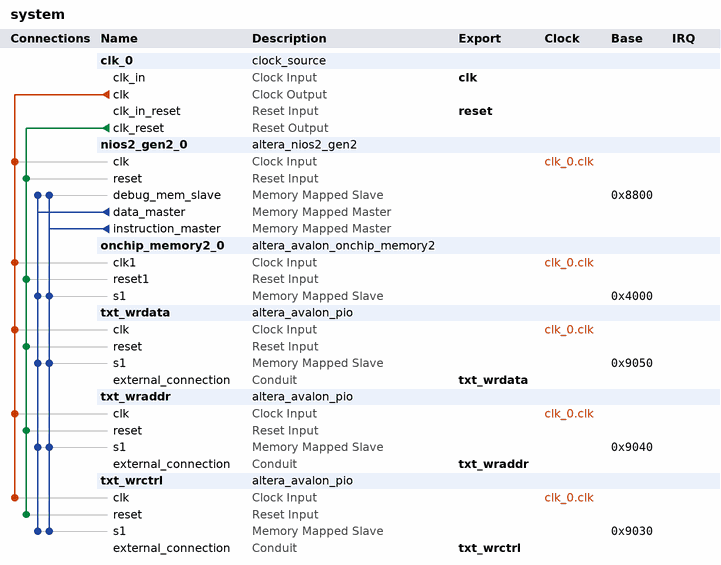
[diagram p0: system contents]
# Platform Designer (Qsys) system system, Cyclone 10 LP 10CL010YE144C8G
# Parameters at their usual value, and those the tool derives, are not listed.
package require -exact qsys 17.1
create_system system
set_project_property DEVICE_FAMILY {Cyclone 10 LP}
set_project_property DEVICE 10CL010YE144C8G

add_instance clk_0 clock_source 17.1
set_instance_parameter_value clk_0 clockFrequency 50000000

add_instance nios2_gen2_0 altera_nios2_gen2 17.1
set_instance_parameter_value nios2_gen2_0 dcache_size 2048
set_instance_parameter_value nios2_gen2_0 exceptionSlave Absolute
set_instance_parameter_value nios2_gen2_0 icache_size 4096
set_instance_parameter_value nios2_gen2_0 impl Tiny
set_instance_parameter_value nios2_gen2_0 resetSlave Absolute

add_instance onchip_memory2_0 altera_avalon_onchip_memory2 17.1
set_instance_parameter_value onchip_memory2_0 dataWidth 32
set_instance_parameter_value onchip_memory2_0 dualPort false
set_instance_parameter_value onchip_memory2_0 initMemContent true
set_instance_parameter_value onchip_memory2_0 initializationFileName onchip_mem.hex
set_instance_parameter_value onchip_memory2_0 memorySize 15360

add_instance txt_wrdata altera_avalon_pio 17.1
set_instance_parameter_value txt_wrdata direction Output
set_instance_parameter_value txt_wrdata width 3

add_instance txt_wraddr altera_avalon_pio 17.1
set_instance_parameter_value txt_wraddr direction Output
set_instance_parameter_value txt_wraddr width 16

add_instance txt_wrctrl altera_avalon_pio 17.1
set_instance_parameter_value txt_wrctrl direction Output
set_instance_parameter_value txt_wrctrl width 2

# connections
add_connection clk_0.clk nios2_gen2_0.clk clock
add_connection clk_0.clk onchip_memory2_0.clk1 clock
add_connection clk_0.clk txt_wraddr.clk clock
add_connection clk_0.clk txt_wrctrl.clk clock
add_connection clk_0.clk txt_wrdata.clk clock
add_connection clk_0.clk_reset nios2_gen2_0.reset reset
add_connection clk_0.clk_reset onchip_memory2_0.reset1 reset
add_connection clk_0.clk_reset txt_wraddr.reset reset
add_connection clk_0.clk_reset txt_wrctrl.reset reset
add_connection clk_0.clk_reset txt_wrdata.reset reset
add_connection nios2_gen2_0.data_master nios2_gen2_0.debug_mem_slave avalon
set_connection_parameter_value nios2_gen2_0.data_master/nios2_gen2_0.debug_mem_slave baseAddress 0x8800
add_connection nios2_gen2_0.data_master onchip_memory2_0.s1 avalon
set_connection_parameter_value nios2_gen2_0.data_master/onchip_memory2_0.s1 baseAddress 0x4000
add_connection nios2_gen2_0.data_master txt_wraddr.s1 avalon
set_connection_parameter_value nios2_gen2_0.data_master/txt_wraddr.s1 baseAddress 0x9040
add_connection nios2_gen2_0.data_master txt_wrctrl.s1 avalon
set_connection_parameter_value nios2_gen2_0.data_master/txt_wrctrl.s1 baseAddress 0x9030
add_connection nios2_gen2_0.data_master txt_wrdata.s1 avalon
set_connection_parameter_value nios2_gen2_0.data_master/txt_wrdata.s1 baseAddress 0x9050
add_connection nios2_gen2_0.instruction_master nios2_gen2_0.debug_mem_slave avalon
set_connection_parameter_value nios2_gen2_0.instruction_master/nios2_gen2_0.debug_mem_slave baseAddress 0x8800
add_connection nios2_gen2_0.instruction_master onchip_memory2_0.s1 avalon
set_connection_parameter_value nios2_gen2_0.instruction_master/onchip_memory2_0.s1 baseAddress 0x4000
add_connection nios2_gen2_0.instruction_master txt_wraddr.s1 avalon
set_connection_parameter_value nios2_gen2_0.instruction_master/txt_wraddr.s1 baseAddress 0x9040
add_connection nios2_gen2_0.instruction_master txt_wrctrl.s1 avalon
set_connection_parameter_value nios2_gen2_0.instruction_master/txt_wrctrl.s1 baseAddress 0x9030
add_connection nios2_gen2_0.instruction_master txt_wrdata.s1 avalon
set_connection_parameter_value nios2_gen2_0.instruction_master/txt_wrdata.s1 baseAddress 0x9050

# exported interfaces
add_interface clk clock sink
set_interface_property clk EXPORT_OF clk_0.clk_in
add_interface reset reset sink
set_interface_property reset EXPORT_OF clk_0.clk_in_reset
add_interface txt_wraddr conduit end
set_interface_property txt_wraddr EXPORT_OF txt_wraddr.external_connection
add_interface txt_wrctrl conduit end
set_interface_property txt_wrctrl EXPORT_OF txt_wrctrl.external_connection
add_interface txt_wrdata conduit end
set_interface_property txt_wrdata EXPORT_OF txt_wrdata.external_connection

set_interconnect_requirement {$system} qsys_mm.clockCrossingAdapter HANDSHAKE
set_interconnect_requirement {$system} qsys_mm.enableEccProtection FALSE
set_interconnect_requirement {$system} qsys_mm.insertDefaultSlave FALSE
set_interconnect_requirement {$system} qsys_mm.maxAdditionalLatency 1

save_system system.qsys
